# Altium schematic sheet MotorMCU.SchDoc
size A4; Revision: 2
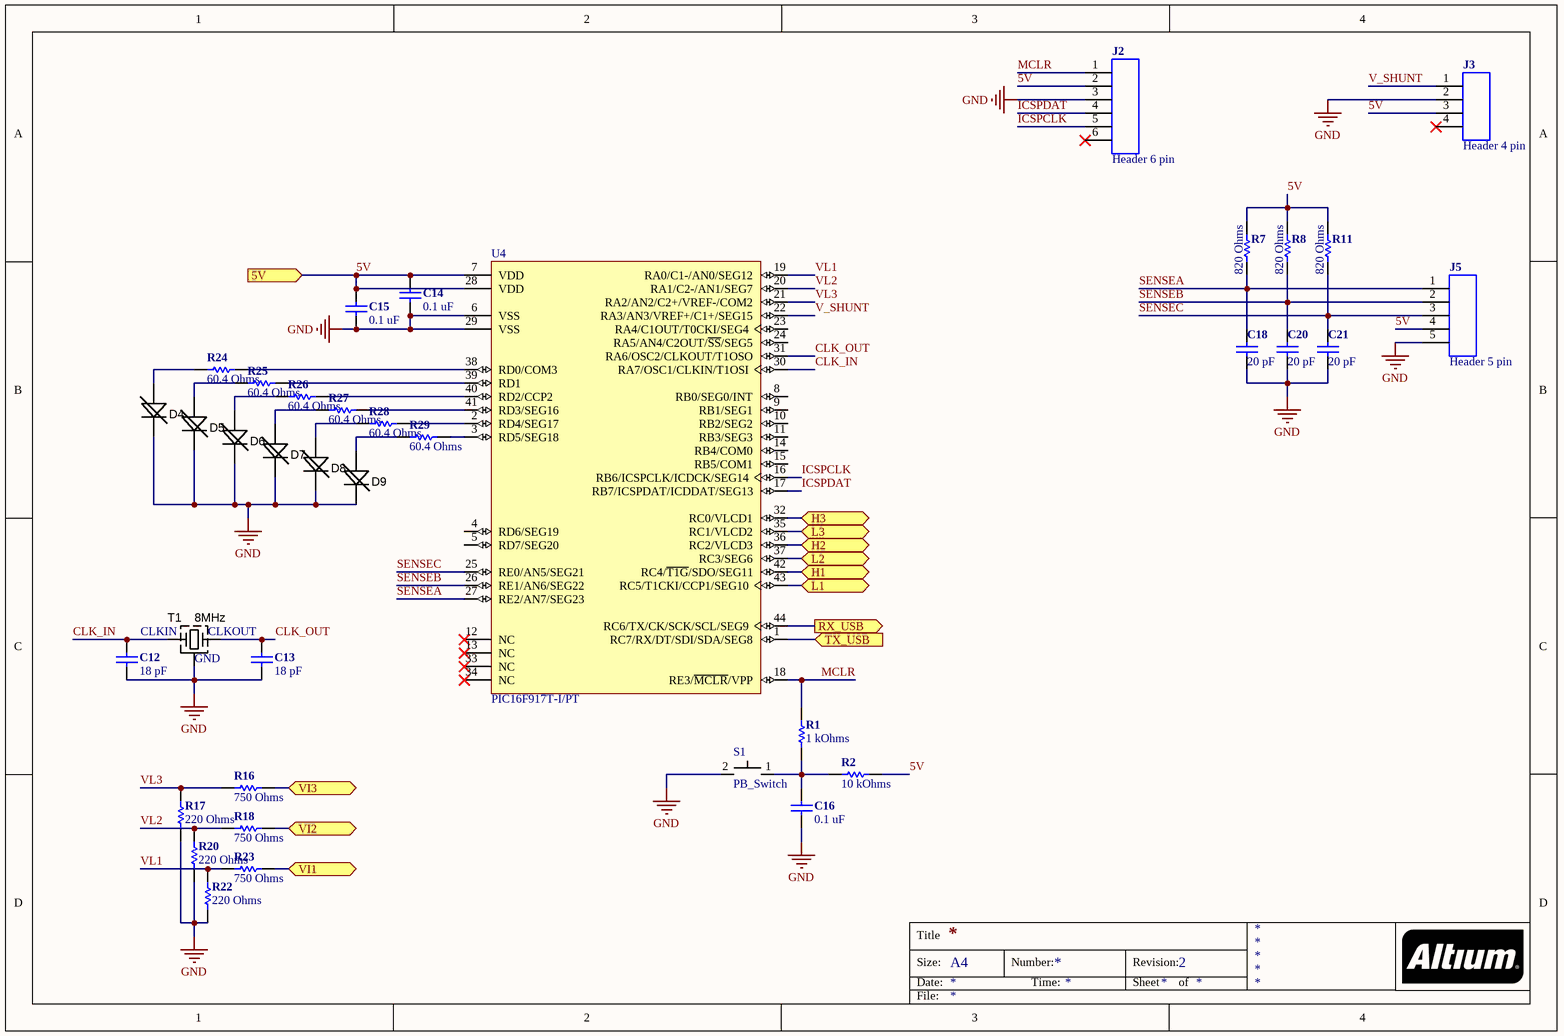
[diagram p0: MotorMCU.SchDoc]

## Parts
C12  18 pF  [CAP-0603(1608)-R]
C13  18 pF  [CAP-0603(1608)-R]
C14  0.1 uF  [CAP-0402(1005)-R]
C15  0.1 uF  [CAP-0402(1005)-R]
C16  0.1 uF  [CAP-0402(1005)-R]
C18  20 pF  [CAP-0402(1005)-R]
C20  20 pF  [CAP-0402(1005)-R]
C21  20 pF  [CAP-0402(1005)-R]
D4  Red  [LED-1206]  (value not drawn)
D5  Red  [LED-1206]  (value not drawn)
D6  Red  [LED-1206]  (value not drawn)
D7  Red  [LED-1206]  (value not drawn)
D8  Red  [LED-1206]  (value not drawn)
D9  Red  [LED-1206]  (value not drawn)
J2  Header 6 pin  [HEADER-6-100mil]
J3  Header 4 pin  [HEADER-4-100mil]
J5  Header 5 pin  [HEADER-5-100mil]
R1  1 kOhms  [R-0402(1005)-R]
R2  10 kOhms  [R-0603(1608)-R]
R7  820 Ohms  [R-0603(1608)-R]
R8  820 Ohms  [R-0603(1608)-R]
R11  820 Ohms  [R-0603(1608)-R]
R16  750 Ohms  [R-0603(1608)-R]
R17  220 Ohms  [R-0603(1608)-R]
R18  750 Ohms  [R-0603(1608)-R]
R20  220 Ohms  [R-0603(1608)-R]
R22  220 Ohms  [R-0603(1608)-R]
R23  750 Ohms  [R-0603(1608)-R]
R24  60.4 Ohms  [R-0603(1608)-R]
R25  60.4 Ohms  [R-0603(1608)-R]
R26  60.4 Ohms  [R-0603(1608)-R]
R27  60.4 Ohms  [R-0603(1608)-R]
R28  60.4 Ohms  [R-0603(1608)-R]
R29  60.4 Ohms  [R-0603(1608)-R]
S1  PB_Switch  [Pushbutton_switches]
T1  8MHz  [CRYSTAL-8MHZ]
U4  PIC16F917T-I/PT  [TQFP-44]

## Ports
5V, H1, H2, H3, L1, L2, L3, RX_USB (out), TX_USB (in), VI1, VI2, VI3

## Nets
GND: C12.2 C13.2 C14.2 C15.2 C16.1 C18.2 C20.2 C21.2 D4.K D5.K D6.K D7.K D8.K D9.K J2.3 J3.2 J5.5 R17.2 R20.2 R22.2 S1.2 T1.2(GND) U4.6(VSS) U4.29(VSS)
5V: C14.1 C15.1 J2.2 J3.3 J5.4 R2.2 R7.1 R8.1 R11.1 U4.7(VDD) U4.28(VDD) ; port 5V
CLK_IN: C12.1 T1.1(CLKIN) U4.30(RA7/OSC1/CLKIN/T1OSI)
CLK_OUT: C13.1 T1.3(X) U4.31(RA6/OSC2/CLKOUT/T1OSO)
H1: U4.42(RC4/~{T1G}/SDO/SEG11) ; port H1
H2: U4.36(RC2/VLCD3) ; port H2
H3: U4.32(RC0/VLCD1) ; port H3
ICSPCLK: J2.5 U4.16(RB6/ICSPCLK/ICDCK/SEG14)
ICSPDAT: J2.4 U4.17(RB7/ICSPDAT/ICDDAT/SEG13)
L1: U4.43(RC5/T1CKI/CCP1/SEG10) ; port L1
L2: U4.37(RC3/SEG6) ; port L2
L3: U4.35(RC1/VLCD2) ; port L3
MCLR: J2.1 R1.1 U4.18(RE3/~{MCLR}/VPP)
RX_USB: U4.44(RC6/TX/CK/SCK/SCL/SEG9) ; port RX_USB
SENSEA: C18.1 J5.1 R7.2 U4.27(RE2/AN7/SEG23)
SENSEB: C20.1 J5.2 R8.2 U4.26(RE1/AN6/SEG22)
SENSEC: C21.1 J5.3 R11.2 U4.25(RE0/AN5/SEG21)
TX_USB: U4.1(RC7/RX/DT/SDI/SDA/SEG8) ; port TX_USB
V_SHUNT: J3.1 U4.22(RA3/AN3/VREF+/C1+/SEG15)
VI1: R23.2 ; port VI1
VI2: R18.2 ; port VI2
VI3: R16.2 ; port VI3
VL1: R22.1 R23.1 U4.19(RA0/C1-/AN0/SEG12)
VL2: R18.1 R20.1 U4.20(RA1/C2-/AN1/SEG7)
VL3: R16.1 R17.1 U4.21(RA2/AN2/C2+/VREF-/COM2)
NetC16_2: C16.2 R1.2 R2.1 S1.1
NetD4_A: D4.A R24.1
NetD5_A: D5.A R25.1
NetD6_A: D6.A R26.1
NetD7_A: D7.A R27.1
NetD8_A: D8.A R28.1
NetD9_A: D9.A R29.1
NetR24_2: R24.2 U4.38(RD0/COM3)
NetR25_2: R25.2 U4.39(RD1)
NetR26_2: R26.2 U4.40(RD2/CCP2)
NetR27_2: R27.2 U4.41(RD3/SEG16)
NetR28_2: R28.2 U4.2(RD4/SEG17)
NetR29_2: R29.2 U4.3(RD5/SEG18)

Not connected (* = marked no-connect by the designer): J2 6*; J3 4*; U4 4(RD6/SEG19) 5(RD7/SEG20) 8(RB0/SEG0/INT) 9(RB1/SEG1) 10(RB2/SEG2) 11(RB3/SEG3) 12(NC)* 13(NC)* 14(RB4/COM0) 15(RB5/COM1) 23(RA4/C1OUT/T0CKI/SEG4) 24(RA5/AN4/C2OUT/~{SS}/SEG5) 33(NC)* 34(NC)*

## Notes on the sheet
- Title
- Size:
- Date:
- A4
- Number:
- Time:
- Revision:
- Sheet
- of
- File:
- (in symbol CRYSTAL_8MHz) CLKOUT

## Library data of the parts
C12 C13 = CAP- 18 pF- 25 V-CER-0603(1608): CAP CER 18 pF 10V 5% C0G 0603; Manufacturer: Yageo; Manufacturer Part Number: CC0603FRNPO9BN180; Tolerance: 1 %; Type: Multilayer Ceramic Chip Capacitor; Voltage Rating DC: 50 VDC; Dielectric: C0G (NP0); RoHS: RoHS Compliant By Exemption; Category: Multilayer Ceramic Capacitors MLCC - SMD/SMT; Capacitance: 18 pF; Package / Case: 0603 (1608 metric); Supplier 1: Mouser; Stock 1: 2511; Pricing 1: 1=0.100, 10=0.039, 100=0.027, 1000=0.019, 4000=0.018, 8000=0.017, 24000=0.016, 48000=0.013 (USD); Length: 1.6 mm; Packaging: Reel; Product: General Type MLCCs; Termination Style: SMD/SMT; Width: 0.8 mm; Brand: Yageo; Case Code - in: 0603; Case Code - mm: 1608; Maximum Operating Temperature: + 125 C; Minimum Operating Temperature: - 55 C; RoHS - Mouser: E; Minimum Order Quantity: 1; Reeling: True; ComponentLink1URL: http://www.mouser.com/ds/2/447/UPY-GP_NP0_16V-to-50V_8-3714.pdf; ComponentLink1Description: http://www.mouser.com/ds/2/447/UPY-GP_NP0_16V-to-50V_8-3714.pdf; Supplier Part Number 1: 603-CC603FRNPO9BN180
C14-C16 = CAP- 0.1 uF- 16 V-CER-0402(1005): CAP CER 0.1 UF 16V 5% X7R 0402; Manufacturer: Yageo; Manufacturer Part Number: CC0402KRX7R7BB104; Tolerance: 10 %; Type: Multilayer Ceramic Chip Capacitor; Voltage Rating DC: 16 VDC; Supplier 1: Mouser; RoHS: RoHS Compliant By Exemption; Category: Multilayer Ceramic Capacitors MLCC - SMD/SMT; Stock 1: 655262; Pricing 1: 1=0.100, 10=0.009, 100=0.004, 1000=0.003, 2500=0.002, 10000=0.002 (USD); Capacitance: 0.1 uF; Package / Case: 0402 (1005 metric); Packaging: Reel; Product: General Type MLCCs; Termination Style: SMD/SMT; Brand: Yageo; Case Code - in: 0402; Case Code - mm: 1005; Dielectric: X7R; Maximum Operating Temperature: + 125 C; Minimum Operating Temperature: - 55 C; Standard Pack Qty: 10000; RoHS - Mouser: E; Minimum Order Quantity: 1; Reeling: True; ComponentLink1URL: http://www.mouser.com/ds/2/447/UPY-GPHC_X7R_6.3V-to-50V_8-12304.pdf; ComponentLink1Description: http://www.mouser.com/ds/2/447/UPY-GPHC_X7R_6.3V-to-50V_8-12304.pdf; Supplier Part Number 1: 603-CC402KRX7R7BB104
C18 C20 C21 = CAP- 20 pF- 50 V-CER-0402(1005): CAP CER 20 pF 50V 5% C0G 0402; Manufacturer: Yageo; Manufacturer Part Number: CC0402JRNPO9BN200; Type: Multilayer Ceramic Chip Capacitor; Voltage Rating DC: 50 VDC; Dielectric: C0G (NP0); RoHS: RoHS Compliant By Exemption; Category: Multilayer Ceramic Capacitors MLCC - SMD/SMT; Capacitance: 20 pF; Tolerance: 5 %; Package / Case: 0402 (1005 metric); Supplier 1: Mouser; Stock 1: 75922; Pricing 1: 1=0.100, 10=0.010, 100=0.005, 1000=0.004, 2500=0.003, 10000=0.002 (USD); Length: 1 mm; Packaging: Reel; Product: General Type MLCCs; Termination Style: SMD/SMT; Width: 0.5 mm; Brand: Yageo; Case Code - in: 0402; Case Code - mm: 1005; Maximum Operating Temperature: + 125 C; Minimum Operating Temperature: - 55 C; Standard Pack Qty: 10000; RoHS - Mouser: E; Minimum Order Quantity: 1; Reeling: True; ComponentLink1URL: http://www.mouser.com/ds/2/447/UPY-NP0X7R_MV_100-to-630V_15-594030.pdf; ComponentLink1Description: http://www.mouser.com/ds/2/447/UPY-NP0X7R_MV_100-to-630V_15-594030.pdf; Supplier Part Number 1: 603-CC402JRNPO9BN200
D4-D9 = LED_SMD_RED_0805: LED, 0805 SMD, Red; Manufacturer: Kingbright; Manufacturer Part Number: APTD3216SURCK; Lens Color/Style: Water Clear; LED Size: 3.2 mm x 1.6 mm; Luminous Intensity: 1000 mcd; Viewing Angle: 50 deg; If - Forward Current: 20 mA; Vf - Forward Voltage: 1.95 V; Wavelength/Color Temperature: 630 nm; Package / Case: 1206; Supplier 1: Mouser; RoHS: RoHS Compliant; Category: Standard LEDs - SMD; Stock 1: 52291; Pricing 1: 1=0.270, 10=0.169, 100=0.125, 1000=0.103, 2000=0.092, 10000=0.084, 24000=0.075, 50000=0.071, 100000=0.068 (USD); Illumination Color: Red; Packaging: Reel; Brand: Kingbright; Mounting Style: SMD/SMT; Maximum Operating Temperature: + 85 C; Minimum Operating Temperature: - 40 C; Product Category: LED SMD Super Bright; Standard Pack Qty: 2000; RoHS - Mouser: Y; Minimum Order Quantity: 1; Reeling: True; ComponentLink1URL: http://www.mouser.com/ds/2/216/APTD3216SURCK-65552.pdf; ComponentLink1Description: http://www.mouser.com/ds/2/216/APTD3216SURCK-65552.pdf; Supplier Part Number 1: 604-APTD-3216SURCK
J2 = CON-6Pin-100Mil: Header, 6 pin, .1 pitch; Manufacturer: TE Connectivity / AMP; Manufacturer Part Number: 4-103327-6; Current Rating: 3 A; Mounting Angle: Vertical; Number of Positions: 6 Position; Pitch: 2.54 mm; Insulation Resistance: 5000 MOhms; Mating Post Length: 5.84 mm; Supplier 1: Mouser; Category: Headers & Wire Housings; Stock 1: 9402; Pricing 1: 1=0.230, 25=0.226, 50=0.212, 100=0.198 (USD); Contact Plating: Tin; Housing Material: Thermoplastic; Number of Rows: 1 Row; Operating Temperature Range: - 65 C to + 105 C; Product: Headers; Series: AMPMODU MOD II; Termination Style: Through Hole; Type: Breakaway; Brand: TE Connectivity / AMP; Contact Material: Phosphor Bronze; Flammability Rating: UL 94 V-0; Mounting Style: -; Row Spacing: 2.54 mm; Contact Gender: Pin (Male); Standard Pack Qty: 240; Termination Post Length: 3.05 mm; Tradename: AMPMODU; Minimum Order Quantity: 1; Reeling: False; ComponentLink1URL: http://www.mouser.com/ds/2/418/NG_CD_103327_T_baseFilename-749374.pdf; ComponentLink1Description: http://www.mouser.com/ds/2/418/NG_CD_103327_T_baseFilename-749374.pdf; Supplier Part Number 1: 571-4-103327-6
J3 = CON-4Pin-100Mil: Header, 4 pin, .1 pitch; Manufacturer: Molex; Manufacturer Part Number: 90136-1104; Current Rating: 3 A; Mounting Angle: Vertical; Number of Positions: 4 Position; Voltage Rating: 350 VAC/DC; Pitch: 2.54 mm; Qualification: Commercial; Supplier 1: Mouser; RoHS: RoHS Compliant; Category: Headers & Wire Housings; Stock 1: 2253; Pricing 1: 1=1.17, 10=0.906, 100=0.717, 500=0.646, 1000=0.574, 2000=0.502 (USD); Accessory Type: -; Contact Plating: Tin; Contact Type: -; Housing Material: Polyester; Number of Rows: 1 Row; Packaging: Tray; Product: Headers; Series: 90136; Termination Style: Through Hole; Type: Shrouded; Brand: Molex; Contact Material: Brass; Mounting Style: Straight Pin; Row Spacing: -; Contact Gender: Pin (Male); Product Category: C-Grid Connectors; Standard Pack Qty: 1920; Tradename: C-Grid; RoHS - Mouser: Y; Minimum Order Quantity: 1; Reeling: False; ComponentLink1URL: http://www.mouser.com/ds/2/276/0901361104_PCB_HEADERS-176953.pdf; ComponentLink1Description: http://www.mouser.com/ds/2/276/0901361104_PCB_HEADERS-176953.pdf; Supplier Part Number 1: 538-90136-1104
J5 = CON-5Pin-100Mil: Header, 5 pin, .1 pitch; Manufacturer: Molex; Manufacturer Part Number: 90136-1105; Current Rating: 3 A; Mounting Angle: Vertical; Number of Positions: 5 Position; Voltage Rating: 350 VAC/DC; Pitch: 2.54 mm; Qualification: Commercial; Supplier 1: Mouser; RoHS: RoHS Compliant; Category: Headers & Wire Housings; Stock 1: 2202; Pricing 1: 1=1.17, 10=0.934, 100=0.749, 500=0.675, 1000=0.600, 2000=0.544, 5000=0.525, 10000=0.461 (USD); Accessory Type: -; Contact Plating: Tin; Contact Type: -; Housing Material: Polyester; Number of Rows: 1 Row; Packaging: Tray; Product: Headers; Series: 90136; Termination Style: Through Hole; Type: Shrouded; Brand: Molex; Contact Material: Brass; Mounting Style: Through Hole; Row Spacing: -; Contact Gender: Pin (Male); Product Category: C-Grid Connectors; Standard Pack Qty: 1600; Tradename: C-Grid; RoHS - Mouser: Y; Minimum Order Quantity: 1; Reeling: False; ComponentLink1URL: http://www.mouser.com/ds/2/276/0901361105_PCB_HEADERS-151780.pdf; ComponentLink1Description: http://www.mouser.com/ds/2/276/0901361105_PCB_HEADERS-151780.pdf; Supplier Part Number 1: 538-90136-1105
R1 = R-1K-62.5 mW-0402(1005): RES 1K OHM 62.5 mW 0402(1005) SMD; Manufacturer: Yageo; Manufacturer Part Number: RC0402JR-071KL; Power Rating: 62.5 mW (1/16 W); Temperature Coefficient: 100 PPM / C; Tolerance: 5 %; Voltage Rating: 50 V; RoHS: RoHS Compliant; Category: Thick Film Resistors - SMD; Packaging: Reel; Resistance: 1 kOhms; Package / Case: 0402 (1005 metric); Height: 0.35 mm; Supplier 1: Mouser; Stock 1: 20226; Pricing 1: 1=0.100, 10=0.007, 100=0.002, 2500=0.001, 10000=0.001 (USD); Length: 1 mm; Operating Temperature Range: - 55 C to + 155 C; Product: Thick Film Resistors General Purpose; Series: RC; Termination Style: SMD/SMT; Type: General Purpose Chip Resistor Surface Mount; Width: 0.5 mm; Brand: Yageo; Case Code - in: 0402; Case Code - mm: 1005; Product Category: 0402 SMD Chip Resistors; Standard Pack Qty: 10000; RoHS - Mouser: Y; Minimum Order Quantity: 1; Reeling: True; ComponentLink1URL: http://www.mouser.com/ds/2/447/PYu-RC0402_51_RoHS_L_6_r-8721.pdf; ComponentLink1Description: http://www.mouser.com/ds/2/447/PYu-RC0402_51_RoHS_L_6_r-8721.pdf; Supplier Part Number 1: 603-RC0402JR-071KL
R2 = R-10k-100mW-0603: RES 10k OHM 1/10W 0603 SMD; Manufacturer: Yageo; Manufacturer Part Number: RC0603FR-0710KL; Power Rating: 100 mW; Temperature Coefficient: 100 PPM / C; Tolerance: 1 %; Voltage Rating: 75 V; RoHS: RoHS Compliant; Category: Thick Film Resistors - SMD; Packaging: Reel; Resistance: 10 kOhms; Package / Case: 0603 (1608 metric); Height: 0.45 mm; Supplier 1: Mouser; Stock 1: 240719; Pricing 1: 1=0.100, 10=0.010, 100=0.003, 1000=0.002, 5000=0.002, 10000=0.001 (USD); Length: 1.6 mm; Operating Temperature Range: - 55 C to + 155 C; Product: Thick Film Resistors General Purpose; Series: RC; Termination Style: SMD/SMT; Type: General Purpose Chip Resistor Surface Mount; Width: 0.8 mm; Brand: Yageo; Case Code - in: 0603; Case Code - mm: 1608; Product Category: 0603 SMD Chip Resistors; Standard Pack Qty: 5000; RoHS - Mouser: Y; Minimum Order Quantity: 1; Reeling: True; ComponentLink1URL: http://www.mouser.com/ds/2/447/RC0603-272842.pdf; ComponentLink1Description: http://www.mouser.com/ds/2/447/RC0603-272842.pdf; Supplier Part Number 1: 603-RC0603FR-0710KL
R7 R8 R11 = R-820-100mW-0603(1608): RES 820 OHM 100 mW 0603(1608) SMD; Manufacturer: Yageo; Manufacturer Part Number: RT0603DRD07820RL; Power Rating: 100 mW; Temperature Coefficient: 25 PPM / C; Tolerance: 0.5 %; Voltage Rating: 75 V; RoHS: RoHS Compliant; Category: Thin Film Resistors - SMD; Packaging: Reel; Resistance: 820 Ohms; Package / Case: 0603 (1608 metric); Height: 0.45 mm; Supplier 1: Mouser; Stock 1: 5000; Pricing 1: 1=0.140, 10=0.077, 100=0.027, 1000=0.019, 5000=0.013, 10000=0.012, 25000=0.011, 50000=0.010 (USD); Length: 1.6 mm; Operating Temperature Range: - 55 C to + 125 C; Product: Thin Film Resistors SMD; Series: RT; Termination Style: SMD/SMT; Type: High Precision, High Stability; Width: 0.8 mm; Brand: Yageo; Case Code - in: 0603; Case Code - mm: 1608; RoHS - Mouser: Y; Minimum Order Quantity: 1; Reeling: True; ComponentLink1URL: http://www.mouser.com/ds/2/447/PYu-RT_1-to-0.05_RoHS_L_6-772266.pdf; ComponentLink1Description: http://www.mouser.com/ds/2/447/PYu-RT_1-to-0.05_RoHS_L_6-772266.pdf; Supplier Part Number 1: 603-RT0603DRD07820RL
R16 R18 R23 = R-750-100mW-0603(1608): RES 750 OHM 100 mW 0603(1608) SMD; Manufacturer: Yageo; Manufacturer Part Number: RT0603DRD07750RL; Power Rating: 100 mW; Temperature Coefficient: 25 PPM / C; Tolerance: 0.5 %; Voltage Rating: 75 V; RoHS: RoHS Compliant; Category: Thin Film Resistors - SMD; Packaging: Reel; Resistance: 750 Ohms; Package / Case: 0603 (1608 metric); Height: 0.45 mm; Supplier 1: Mouser; Stock 1: 4747; Pricing 1: 1=0.140, 10=0.077, 100=0.027, 1000=0.019, 5000=0.013, 10000=0.012, 25000=0.011, 50000=0.010 (USD); Length: 1.6 mm; Operating Temperature Range: - 55 C to + 125 C; Product: Thin Film Resistors SMD; Series: RT; Termination Style: SMD/SMT; Type: High Precision, High Stability; Width: 0.8 mm; Brand: Yageo; Case Code - in: 0603; Case Code - mm: 1608; RoHS - Mouser: Y; Minimum Order Quantity: 1; Reeling: True; ComponentLink1URL: http://www.mouser.com/ds/2/447/PYu-RT_1-to-0.05_RoHS_L_6-772266.pdf; ComponentLink1Description: http://www.mouser.com/ds/2/447/PYu-RT_1-to-0.05_RoHS_L_6-772266.pdf; Supplier Part Number 1: 603-RT0603DRD07750RL
R17 R20 R22 = R-220-100 mW-0603(1608): RES 220 OHM 100 mW 0603(1608) SMD; Manufacturer: Yageo; Manufacturer Part Number: RT0603FRE07220RL; Power Rating: 100 mW; Temperature Coefficient: 50 PPM / C; Tolerance: 1 %; Voltage Rating: 75 V; RoHS: RoHS Compliant By Exemption; Category: Thin Film Resistors - SMD; Packaging: Reel; Resistance: 220 Ohms; Package / Case: 0603 (1608 metric); Height: 0.45 mm; Supplier 1: Mouser; Stock 1: 6189; Pricing 1: 1=0.190, 10=0.046, 100=0.015, 1000=0.011, 5000=0.007, 25000=0.006, 50000=0.005 (USD); Length: 1.6 mm; Operating Temperature Range: - 55 C to + 125 C; Product: Thin Film Resistors SMD; Series: RT; Termination Style: SMD/SMT; Type: High Precision, High Stability; Width: 0.8 mm; Brand: Yageo; Case Code - in: 0603; Case Code - mm: 1608; RoHS - Mouser: E; Minimum Order Quantity: 1; Reeling: True; ComponentLink1URL: http://www.mouser.com/ds/2/447/PYu-RT_1-to-0.05_RoHS_L_6-772266.pdf; ComponentLink1Description: http://www.mouser.com/ds/2/447/PYu-RT_1-to-0.05_RoHS_L_6-772266.pdf; Supplier Part Number 1: 603-RT0603FRE07220RL
R24-R29 = R-60.4-100mW-0805: RES 60.4 OHM 100 mW  SMD; Manufacturer: Yageo; Manufacturer Part Number: RC0603FR-0760R4L; Power Rating: 100 mW; Temperature Coefficient: 100 PPM / C; Tolerance: 1 %; Voltage Rating: 75 V; RoHS: RoHS Compliant; Category: Thick Film Resistors - SMD; Packaging: Reel; Resistance: 60.4 Ohms; Package / Case: 0603 (1608 metric); Height: 0.45 mm; Supplier 1: Mouser; Stock 1: 5823; Pricing 1: 1=0.100, 10=0.010, 100=0.003, 1000=0.002, 5000=0.002, 10000=0.001 (USD); Length: 1.6 mm; Operating Temperature Range: - 55 C to + 155 C; Product: Thick Film Resistors General Purpose; Series: RC; Termination Style: SMD/SMT; Type: General Purpose Chip Resistor Surface Mount; Width: 0.8 mm; Brand: Yageo; Case Code - in: 0603; Case Code - mm: 1608; RoHS - Mouser: Y; Minimum Order Quantity: 1; Reeling: True; ComponentLink1URL: http://www.mouser.com/ds/2/447/RC0603-272842.pdf; ComponentLink1Description: http://www.mouser.com/ds/2/447/RC0603-272842.pdf; Supplier Part Number 1: 603-RC0603FR-0760R4L
S1 = PB_Switch: Manufacturer: TE Connectivity / Alcoswitch; Manufacturer Part Number: 2-1437565-8; Actuator: Round; Contact Form: SPST; Current Rating: 50 mA; Illumination: None; Switch Function: OFF - (ON); Voltage Rating DC: 24 VDC; Supplier 1: Mouser; Category: Pushbutton Switches; Stock 1: 18161; Pricing 1: 1=0.140, 10=0.130, 25=0.117, 50=0.108, 100=0.097, 200=0.092, 500=0.087, 1000=0.083 (USD); Contact Plating: Silver; Height: 4.3 mm; Material: Polyamide; Termination Style: Solder Pin; Brand: TE Connectivity / Alcoswitch; Mounting Style: SMD/SMT; Product Category: Pushbutton Switches; Standard Pack Qty: 750; Minimum Order Quantity: 1; Reeling: False; ComponentLink1URL: http://www.mouser.com/ds/2/418/NG_CD_2-1437565-7_V-663783.pdf; ComponentLink1Description: http://www.mouser.com/ds/2/418/NG_CD_2-1437565-7_V-663783.pdf; Supplier Part Number 1: 506-2-1437565-8
T1 = CRYSTAL_8MHz: Oscillator Crystal 8MHz 10ppm; Manufacturer: ABRACON; Manufacturer Part Number: ABMM2-8.000MHZ-E2-T; Type: Ceramic Low Profile Quartz Crystal; Frequency Stability: 20 PPM; Load Capacitance: 18 pF; ESR: 72 Ohms; Package / Case: 6 mm x 3.6 mm; Supplier 1: Mouser; RoHS: RoHS Compliant; Category: Crystals; Stock 1: 13032; Pricing 1: 1=0.930, 10=0.823, 50=0.720, 100=0.650, 200=0.630, 500=0.520, 1000=0.470, 2000=0.460, 5000=0.442 (USD); Frequency: 8 MHz; Height: 1.2 mm; Length: 6 mm; Operating Temperature Range: - 20 C to + 70 C; Packaging: Reel; Series: ABMM2; Termination Style: SMD/SMT; Tolerance: 20 PPM; Width: 3.6 mm; Brand: ABRACON; Mounting Style: SMD/SMT; Product Category: SMD Crystals; Standard Pack Qty: 1000; RoHS - Mouser: Y; Minimum Order Quantity: 1; Reeling: True; ComponentLink1URL: http://www.mouser.com/ds/2/3/ABMM2-40161.pdf; ComponentLink1Description: http://www.mouser.com/ds/2/3/ABMM2-40161.pdf; Supplier Part Number 1: 815-ABMM2-8-E2T
U4 = PIC16F917: Flash-Based, 8-Bit CMOS Microcontroller with LCD Driver and nanoWatt Technology, 8K (x14-Bit words) Program Memory, 608 Bytes Data Memory, 35 I/O pins, 44-Pin TQFP, Standard VDD Range, Industrial Temperature, Tape and Reel; Manufacturer: Microchip Technology; Manufacturer Part Number: PIC16F917-I/PT; Program Memory Type: Flash; Data RAM Size: 352 B; Data RAM Type: RAM; Data ROM Size: 256 B; Data ROM Type: EEPROM; Interface Type: AUSART, I2C, SPI, SSP; Number of I/Os: 35 I/O; Program Memory Size: 14 kB; ADC Resolution: 10 bit; Core: PIC16; Data Bus Width: 8 bit; Maximum Clock Frequency: 20 MHz; Number of ADC Channels: 8; Number of Timers/Counters: 2 Timer; Operating Supply Voltage: 2 V to 5.5 V; PackagingOptionsScrubbed: PIC16F917TIPT; Supply Voltage - Max: 5.5 V; Supply Voltage - Min: 4.5 V; Supplier 1: Mouser; RoHS: RoHS Compliant; Category: 8-bit Microcontrollers - MCU; Stock 1: 160; Pricing 1: 1=3.59, 10=2.99, 25=2.74, 100=2.48 (USD); Package / Case: TQFP-44; Packaging: Tray; Product: MCU; Series: PIC16F917; Brand: Microchip Technology; Mounting Style: SMD/SMT; Maximum Operating Temperature: + 85 C; Minimum Operating Temperature: - 40 C; Processor Series: PIC16; Product Category: PICmicro MCUs; Standard Pack Qty: 160; RoHS - Mouser: Y; Minimum Order Quantity: 1; Reeling: False; ComponentLink1URL: http://www.mouser.com/ds/2/268/41250B-80422.pdf; ComponentLink1Description: http://www.mouser.com/ds/2/268/41250B-80422.pdf; Supplier Part Number 1: 579-PIC16F917-I/PT